# EAGLE design PCB (EAGLE 9.6.2)
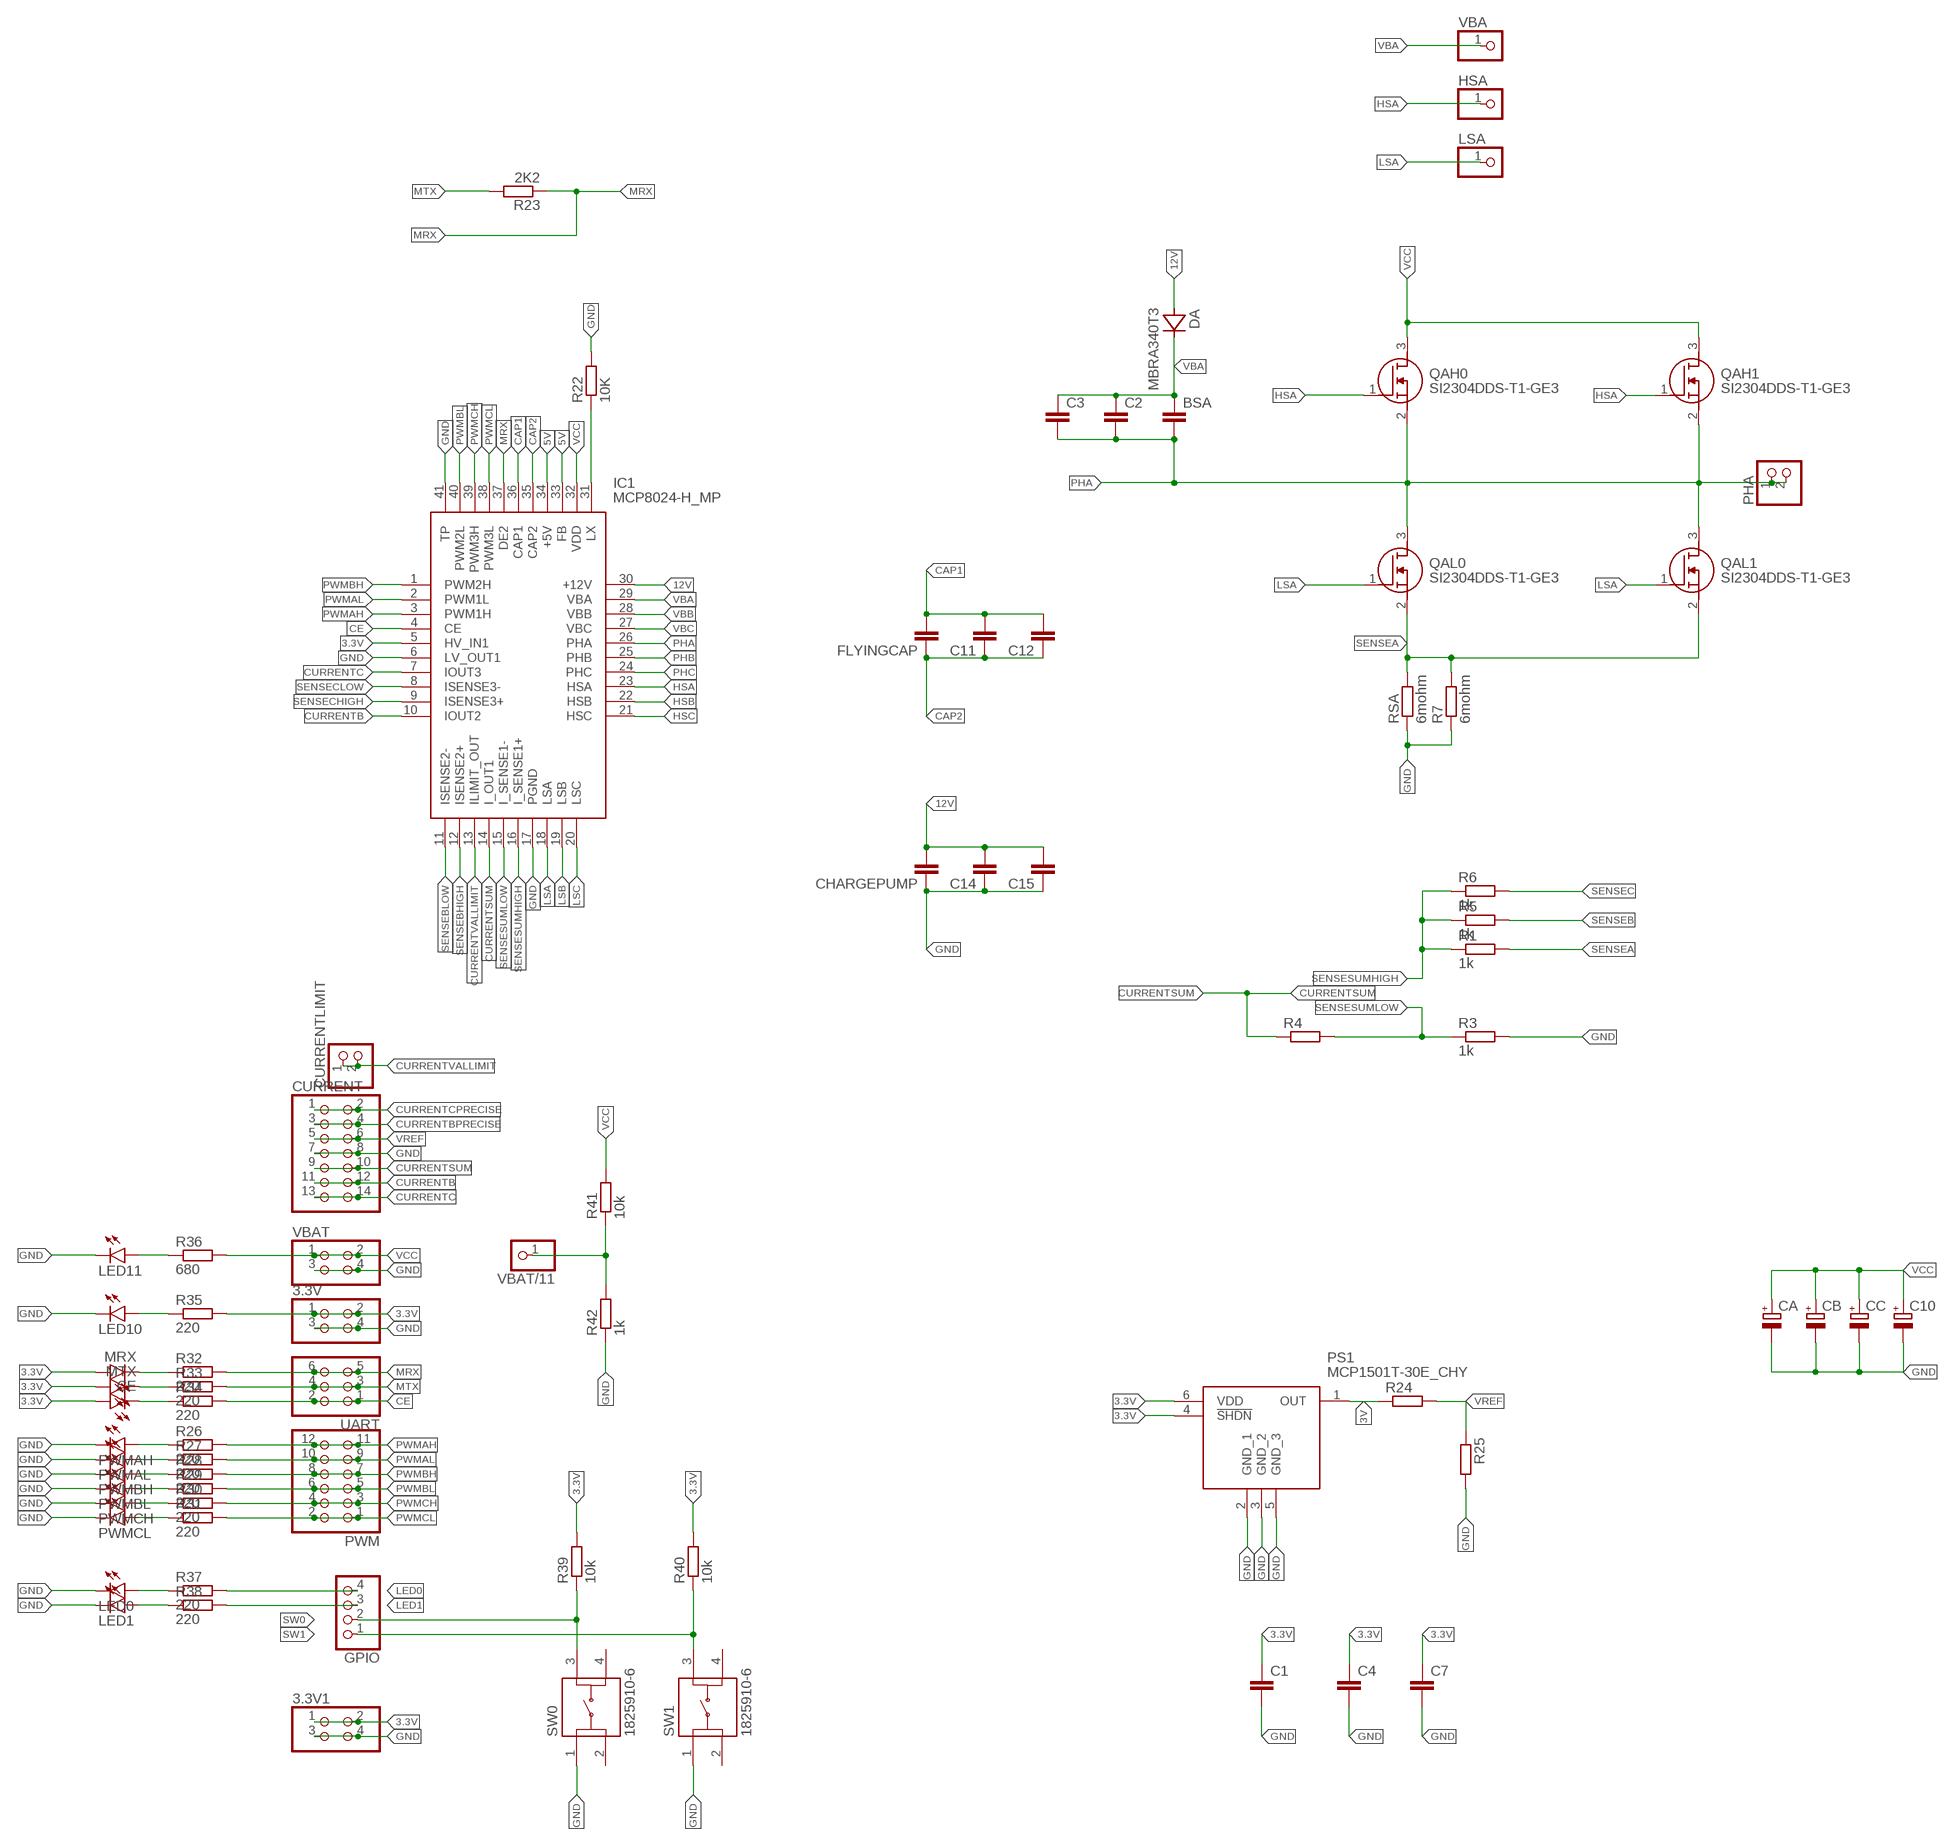
[diagram p0: schematic, sheet 1, part 1 of 2]
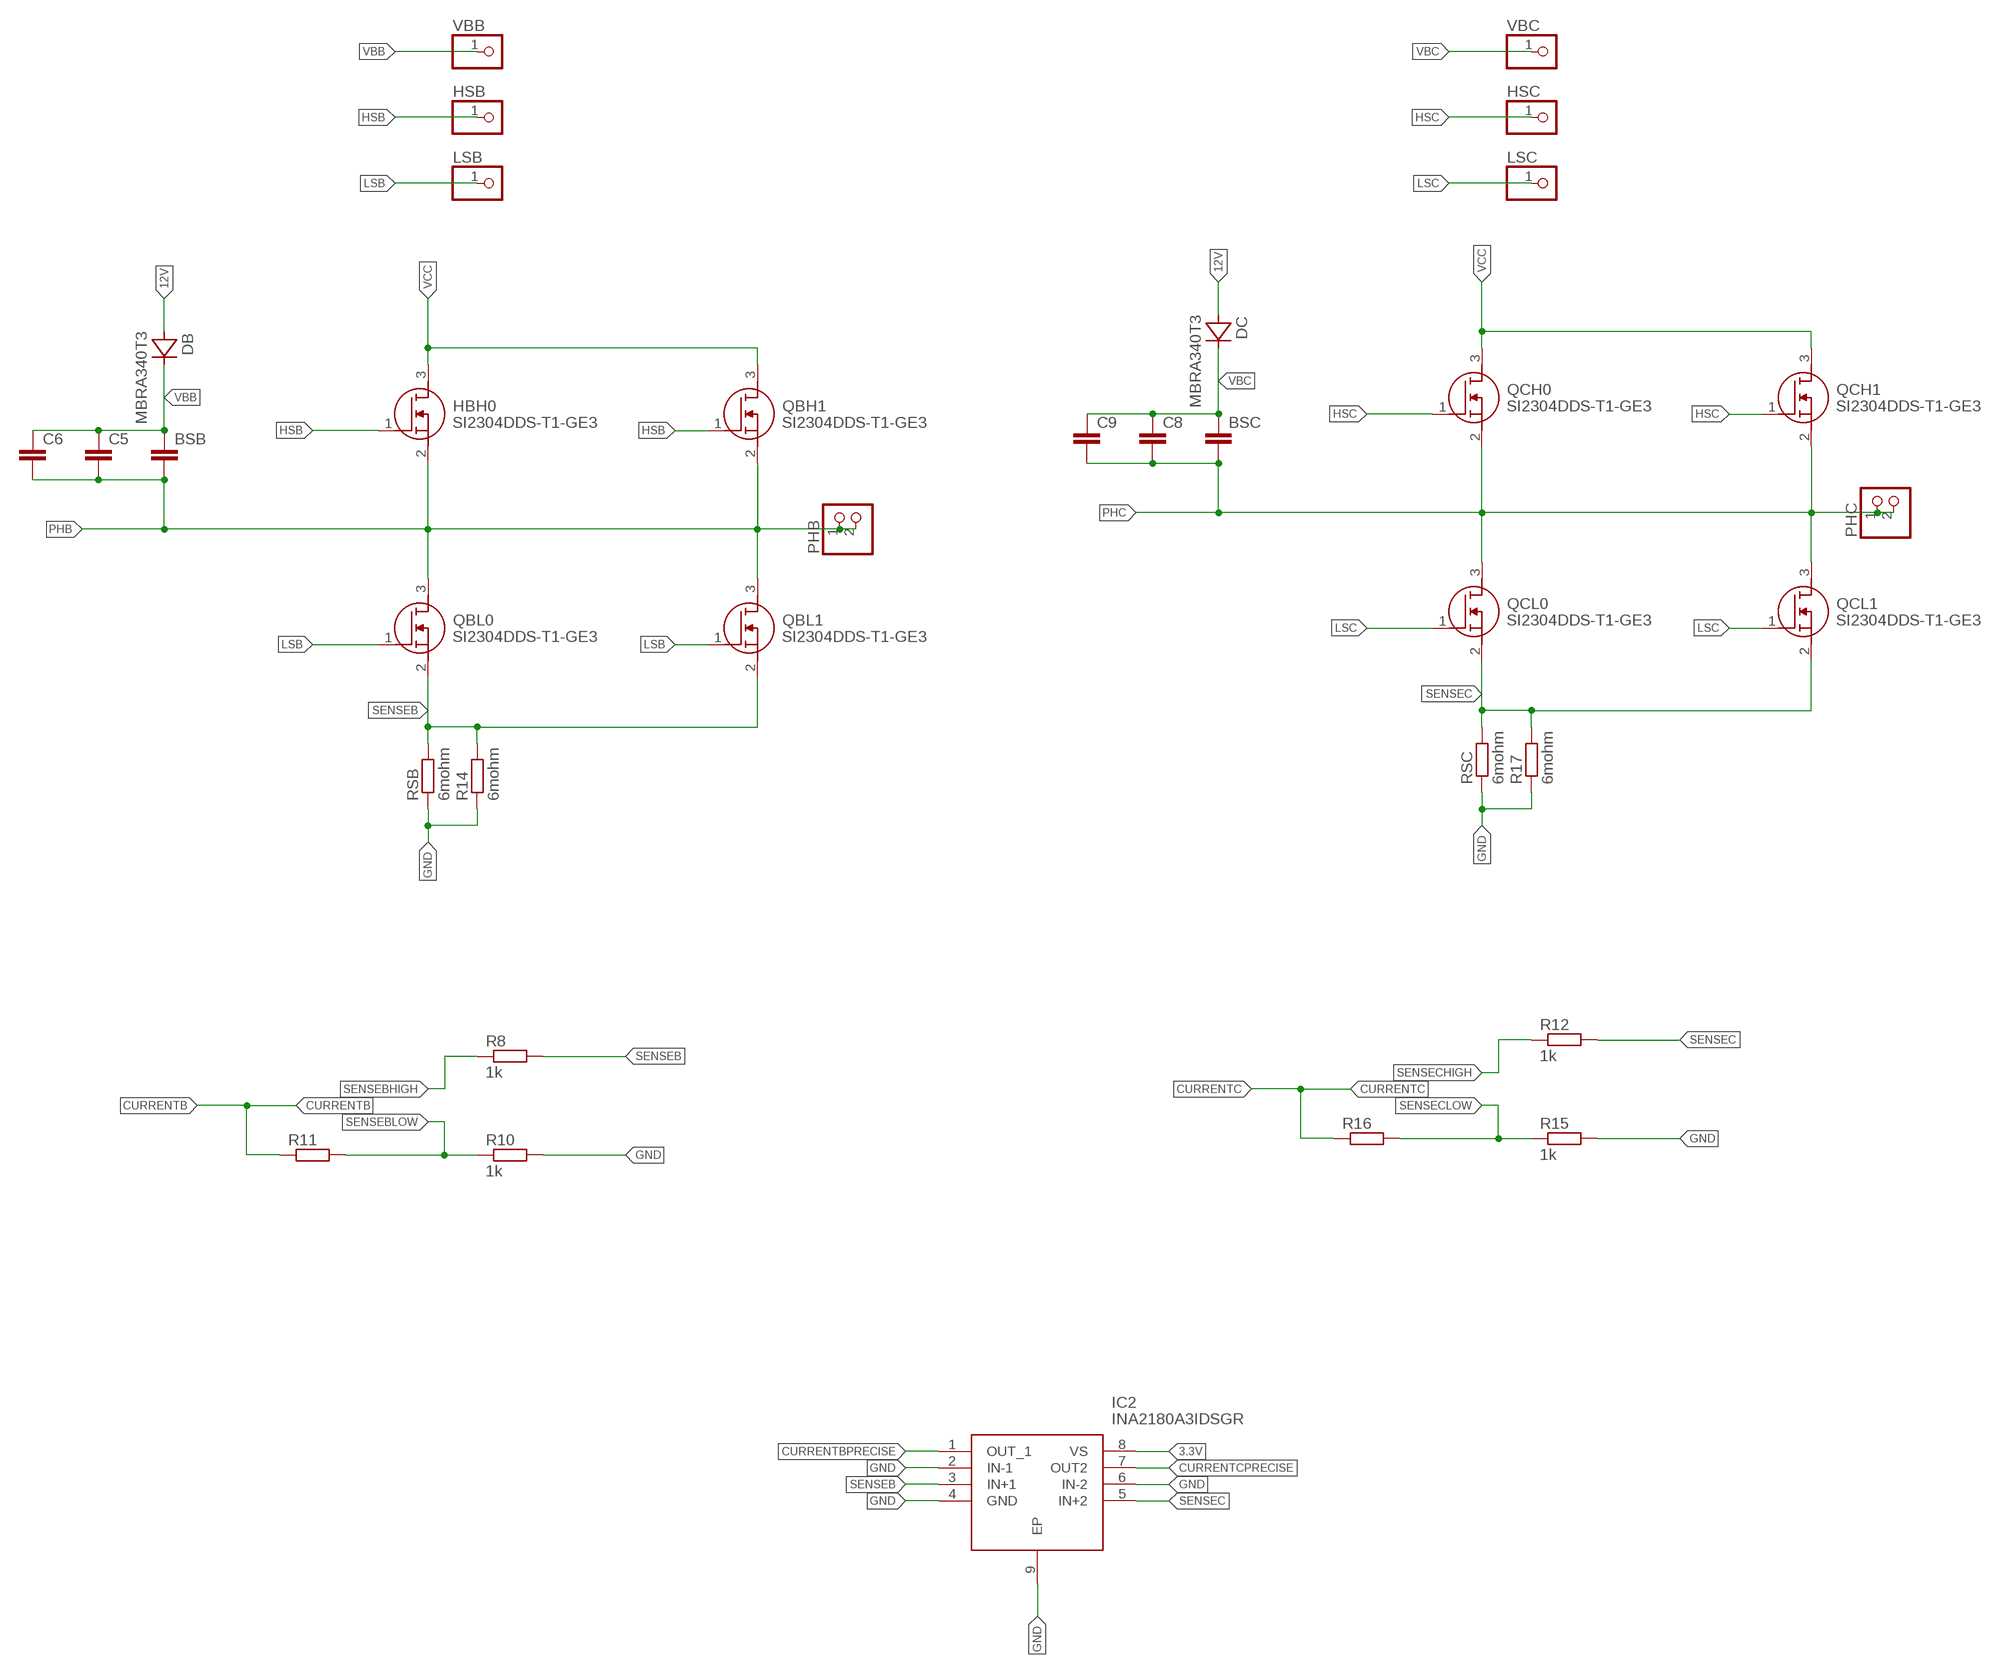
[diagram p1: schematic, sheet 1, part 2 of 2]

## Parts
3.3V  PINHD-2X2  [2X02]
3.3V1  PINHD-2X2  [2X02]
BSA  C-EUC0603  [C0603]
BSB  C-EUC0603  [C0603]
BSC  C-EUC0603  [C0603]
C1  C-EUC0603  [C0603]
C2  C-EUC0603  [C0603]
C3  C-EUC0603  [C0603]
C4  C-EUC0603  [C0603]
C5  C-EUC0603  [C0603]
C6  C-EUC0603  [C0603]
C7  C-EUC0603  [C0603]
C8  C-EUC0603  [C0603]
C9  C-EUC0603  [C0603]
C10  CPOL-EUE3.5-8  [E3,5-8]
C11  C-EUC0603  [C0603]
C12  C-EUC0603  [C0603]
C14  C-EUC0603  [C0603]
C15  C-EUC0603  [C0603]
CA  CPOL-EUE3.5-8  [E3,5-8]
CB  CPOL-EUE3.5-8  [E3,5-8]
CC  CPOL-EUE3.5-8  [E3,5-8]
CE  LEDCHIPLED_0805  [CHIPLED_0805]
CHARGEPUMP  C-EUC0603  [C0603]
CURRENT  PINHD-2X7  [2X07]
CURRENTLIMIT  PINHD-1X2  [1X02]
DA  MBRA340T3  [SMA]
DB  MBRA340T3  [SMA]
DC  MBRA340T3  [SMA]
FLYINGCAP  C-EUC0603  [C0603]
GPIO  PINHD-1X4  [1X04]
HBH0  SI2304DDS-T1-GE3  [SOT95P237X112-3N]
HSA  PINHD-1X1  [1X01]
HSB  PINHD-1X1  [1X01]
HSC  PINHD-1X1  [1X01]
IC1  MCP8024-H_MP  [QFN40P500X500X90-41N]
IC2  INA2180A3IDSGR  [SON50P200X200X80-9N]
LED0  LEDCHIPLED_0805  [CHIPLED_0805]
LED1  LEDCHIPLED_0805  [CHIPLED_0805]
LED10  LEDCHIPLED_0805  [CHIPLED_0805]
LED11  LEDCHIPLED_0805  [CHIPLED_0805]
LSA  PINHD-1X1  [1X01]
LSB  PINHD-1X1  [1X01]
LSC  PINHD-1X1  [1X01]
MRX  LEDCHIPLED_0805  [CHIPLED_0805]
MTX  LEDCHIPLED_0805  [CHIPLED_0805]
PHA  PINHD-1X2  [1X02]
PHB  PINHD-1X2  [1X02]
PHC  PINHD-1X2  [1X02]
PS1  MCP1501T-30E_CHY  [SOT95P270X145-6N]
PWM  PINHD-2X6  [2X06]
PWMAH  LEDCHIPLED_0805  [CHIPLED_0805]
PWMAL  LEDCHIPLED_0805  [CHIPLED_0805]
PWMBH  LEDCHIPLED_0805  [CHIPLED_0805]
PWMBL  LEDCHIPLED_0805  [CHIPLED_0805]
PWMCH  LEDCHIPLED_0805  [CHIPLED_0805]
PWMCL  LEDCHIPLED_0805  [CHIPLED_0805]
QAH0  SI2304DDS-T1-GE3  [SOT95P237X112-3N]
QAH1  SI2304DDS-T1-GE3  [SOT95P237X112-3N]
QAL0  SI2304DDS-T1-GE3  [SOT95P237X112-3N]
QAL1  SI2304DDS-T1-GE3  [SOT95P237X112-3N]
QBH1  SI2304DDS-T1-GE3  [SOT95P237X112-3N]
QBL0  SI2304DDS-T1-GE3  [SOT95P237X112-3N]
QBL1  SI2304DDS-T1-GE3  [SOT95P237X112-3N]
QCH0  SI2304DDS-T1-GE3  [SOT95P237X112-3N]
QCH1  SI2304DDS-T1-GE3  [SOT95P237X112-3N]
QCL0  SI2304DDS-T1-GE3  [SOT95P237X112-3N]
QCL1  SI2304DDS-T1-GE3  [SOT95P237X112-3N]
R1  1k  R-EU_R0805  [R0805]
R3  1k  R-EU_R0805  [R0805]
R4  R-EU_R0805  [R0805]
R5  1k  R-EU_R0805  [R0805]
R6  1k  R-EU_R0805  [R0805]
R7  6mohm  R-EU_R1206  [R1206]
R8  1k  R-EU_R0805  [R0805]
R10  1k  R-EU_R0805  [R0805]
R11  R-EU_R0805  [R0805]
R12  1k  R-EU_R0805  [R0805]
R14  6mohm  R-EU_R1206  [R1206]
R15  1k  R-EU_R0805  [R0805]
R16  R-EU_R0805  [R0805]
R17  6mohm  R-EU_R1206  [R1206]
R22  10K  R-EU_R0805  [R0805]
R23  2K2  R-EU_R0805  [R0805]
R24  R-EU_R0805  [R0805]
R25  R-EU_R0805  [R0805]
R26  220  R-EU_R0805  [R0805]
R27  220  R-EU_R0805  [R0805]
R28  220  R-EU_R0805  [R0805]
R29  220  R-EU_R0805  [R0805]
R30  220  R-EU_R0805  [R0805]
R31  220  R-EU_R0805  [R0805]
R32  220  R-EU_R0805  [R0805]
R33  220  R-EU_R0805  [R0805]
R34  220  R-EU_R0805  [R0805]
R35  220  R-EU_R0805  [R0805]
R36  680  R-EU_R0805  [R0805]
R37  220  R-EU_R0805  [R0805]
R38  220  R-EU_R0805  [R0805]
R39  10k  R-EU_R0805  [R0805]
R40  10k  R-EU_R0805  [R0805]
R41  10k  R-EU_R0805  [R0805]
R42  1k  R-EU_R0805  [R0805]
RSA  6mohm  R-EU_R1206  [R1206]
RSB  6mohm  R-EU_R1206  [R1206]
RSC  6mohm  R-EU_R1206  [R1206]
SW0  1825910-6  [1825910-6]
SW1  1825910-6  [1825910-6]
UART  PINHD-2X3  [2X03]
VBA  PINHD-1X1  [1X01]
VBAT  PINHD-2X2  [2X02]
VBAT/11  PINHD-1X1  [1X01]
VBB  PINHD-1X1  [1X01]
VBC  PINHD-1X1  [1X01]

## Nets
3.3V: 3.3V1.1 3.3V1.2 3.3V.1 3.3V.2 C1.1 C4.1 C7.1 CE.A IC1.5(HV_IN1) IC2.8(VS) MRX.A MTX.A PS1.4(!SHDN) PS1.6(VDD) R35.2 R39.2 R40.2
3V: PS1.1(OUT) R24.1
5V: IC1.33(FB) IC1.34(+5V)
12V: C14.2 C15.2 CHARGEPUMP.2 DA.A DB.A DC.A IC1.30(+12V)
CAP1: C11.2 C12.2 FLYINGCAP.2 IC1.36(CAP1)
CAP2: C11.1 C12.1 FLYINGCAP.1 IC1.35(CAP2)
CE: IC1.4(CE) R34.2 UART.1 UART.2
CURRENTB: CURRENT.11 CURRENT.12 IC1.10(IOUT2) R11.1
CURRENTBPRECISE: CURRENT.3 CURRENT.4 IC2.1(OUT_1)
CURRENTC: CURRENT.13 CURRENT.14 IC1.7(IOUT3) R16.1
CURRENTCPRECISE: CURRENT.1 CURRENT.2 IC2.7(OUT2)
CURRENTSUM: CURRENT.9 CURRENT.10 IC1.14(I_OUT1) R4.1
CURRENTVALLIMIT: CURRENTLIMIT.1 CURRENTLIMIT.2 IC1.13(ILIMIT_OUT)
GND: 3.3V1.3 3.3V1.4 3.3V.3 3.3V.4 C1.2 C4.2 C7.2 C10.- C14.1 C15.1 CA.- CB.- CC.- CHARGEPUMP.1 CURRENT.7 CURRENT.8 IC1.6(LV_OUT1) IC1.17(PGND) IC1.41(TP) IC2.2(IN-1) IC2.4(GND) IC2.6(IN-2) IC2.9(EP) LED0.C LED1.C LED10.C LED11.C PS1.2(GND_1) PS1.3(GND_2) PS1.5(GND_3) PWMAH.C PWMAL.C PWMBH.C PWMBL.C PWMCH.C PWMCL.C R3.2 R7.1 R10.2 R14.1 R15.2 R17.1 R22.2 R25.2 R42.1 RSA.1 RSB.1 RSC.1 SW0.1 SW1.1 VBAT.3 VBAT.4
HSA: HSA.1 IC1.23(HSA) QAH0.1(G) QAH1.1(G)
HSB: HBH0.1(G) HSB.1 IC1.22(HSB) QBH1.1(G)
HSC: HSC.1 IC1.21(HSC) QCH0.1(G) QCH1.1(G)
LED0: GPIO.4 R37.2
LED1: GPIO.3 R38.2
LSA: IC1.18(LSA) LSA.1 QAL0.1(G) QAL1.1(G)
LSB: IC1.19(LSB) LSB.1 QBL0.1(G) QBL1.1(G)
LSC: IC1.20(LSC) LSC.1 QCL0.1(G) QCL1.1(G)
MRX: IC1.37(DE2) R23.1 R32.2 UART.5 UART.6
MTX: R23.2 R33.2 UART.3 UART.4
N$1: IC1.31(LX) R22.1
N$2: PWMAH.A R26.1
N$3: PWMAL.A R27.1
N$4: PWMBH.A R28.1
N$5: PWMBL.A R29.1
N$6: PWMCH.A R30.1
N$7: PWMCL.A R31.1
N$8: MRX.C R32.1
N$9: MTX.C R33.1
N$10: CE.C R34.1
N$11: LED10.A R35.1
N$12: LED11.A R36.1
N$13: LED0.A R37.1
N$14: LED1.A R38.1
N$15: R41.1 R42.2 VBAT/11.1
PHA: BSA.2 C2.2 C3.2 IC1.26(PHA) PHA.1 PHA.2 QAH0.2(S) QAH1.2(S) QAL0.3(D) QAL1.3(D)
PHB: BSB.2 C5.2 C6.2 HBH0.2(S) IC1.25(PHB) PHB.1 PHB.2 QBH1.2(S) QBL0.3(D) QBL1.3(D)
PHC: BSC.2 C8.2 C9.2 IC1.24(PHC) PHC.1 PHC.2 QCH0.2(S) QCH1.2(S) QCL0.3(D) QCL1.3(D)
PWMAH: IC1.3(PWM1H) PWM.11 PWM.12 R26.2
PWMAL: IC1.2(PWM1L) PWM.9 PWM.10 R27.2
PWMBH: IC1.1(PWM2H) PWM.7 PWM.8 R28.2
PWMBL: IC1.40(PWM2L) PWM.5 PWM.6 R29.2
PWMCH: IC1.39(PWM3H) PWM.3 PWM.4 R30.2
PWMCL: IC1.38(PWM3L) PWM.1 PWM.2 R31.2
SENSEA: QAL0.2(S) QAL1.2(S) R1.2 R7.2 RSA.2
SENSEB: IC2.3(IN+1) QBL0.2(S) QBL1.2(S) R5.2 R8.2 R14.2 RSB.2
SENSEBHIGH: IC1.12(ISENSE2+) R8.1
SENSEBLOW: IC1.11(ISENSE2-) R10.1 R11.2
SENSEC: IC2.5(IN+2) QCL0.2(S) QCL1.2(S) R6.2 R12.2 R17.2 RSC.2
SENSECHIGH: IC1.9(ISENSE3+) R12.1
SENSECLOW: IC1.8(ISENSE3-) R15.1 R16.2
SENSESUMHIGH: IC1.16(I_SENSE1+) R1.1 R5.1 R6.1
SENSESUMLOW: IC1.15(I_SENSE1-) R3.1 R4.2
SW0: GPIO.2 R39.1 SW0.3
SW1: GPIO.1 R40.1 SW1.3
VBA: BSA.1 C2.1 C3.1 DA.C IC1.29(VBA) VBA.1
VBB: BSB.1 C5.1 C6.1 DB.C IC1.28(VBB) VBB.1
VBC: BSC.1 C8.1 C9.1 DC.C IC1.27(VBC) VBC.1
VCC: C10.+ CA.+ CB.+ CC.+ HBH0.3(D) IC1.32(VDD) QAH0.3(D) QAH1.3(D) QBH1.3(D) QCH0.3(D) QCH1.3(D) R36.2 R41.2 VBAT.1 VBAT.2
VREF: CURRENT.5 CURRENT.6 R24.2 R25.1
Unconnected: SW0.2 SW0.4 SW1.2 SW1.4

## Library data of the parts
3.3V 3.3V1 VBAT = pinhead:PINHD-2X2: PIN HEADER
BSA BSB BSC C1-C9 C11 C12 C14 C15 CHARGEPUMP FLYINGCAP = resistor:C-EU: CAPACITOR, European symbol
C10 CA CB CC = resistor:CPOL-EU: POLARIZED CAPACITOR, European symbol
CE LED0 LED1 LED10 LED11 MRX MTX PWMAH PWMAL PWMBH PWMBL PWMCH PWMCL = led:LED: LED OSRAM: - CHIPLED LG R971, LG N971, LY N971, LG Q971, LY Q971, LO R971, LY R971 LH N974, LH R974 LS Q976, LO Q976, LY Q976 LO Q996 - Hyper CHIPLED LW Q18S LB Q993, LB Q99A, LB R99A - SideLED LS A670, LO A670, LY A670, LG A670, LP A670 LB A673, LV A673, LT A673, LW A673 LH A674 LY A675 LS A676, LA A676, LO A676, LY A676, LW A676 LS A679, LY A679, LG A679 - Hyper Micro SIDELED® LS Y876, LA Y876, LO Y876, LY Y876 LT Y87S - SmartLED LW L88C, LW L88S LB L89C, LB L89S, LG L890 LS L89K, LO L89K, LY L89K LS L896, LA L896, LO L896, LY L896 - TOPLED LS T670, LO T670, LY T670, LG T670, LP T670 LSG T670, LSP T670, LSY T670, LOP T670, LYG T670 LG T671, LOG T671, LSG T671 LB T673, LV T673, LT T673, LW T673 LH T674 LS T676, LA T676, LO T676, LY T676, LB T676, LH T676, LSB T676, LW T676 LB T67C, LV T67C, LT T67C, LS T67K, LO T67K, LY T67K, LW E67C LS E67B, LA E67B, LO E67B, LY E67B, LB E67C, LV E67C, LT E67C LW T67C LS T679, LY T679, LG T679 LS T770, LO T770, LY T770, LG T770, LP T770 LB T773, LV T773, LT T773, LW T773 LH T774 LS E675, LA E675, LY E675, LS T675 LS T776, LA T776, LO T776, LY T776, LB T776 LHGB T686 LT T68C, LB T68C - Hyper Mini TOPLED® LB M676 - Mini TOPLED Santana® LG M470 LS M47K, LO M47K, LY M47K Source: http://www.osram.convergy.de LUXEON: - LUMILED® LXK2-PW12-R00, LXK2-PW12-S00, LXK2-PW14-U00, LXK2-PW14-V00 LXK2-PM12-R00, LXK2-PM12-S00, LXK2-PM14-U00 LXK2-PE12-Q00, LXK2-PE12-R00, LXK2-PE12-S00, LXK2-PE14-T00, LXK2-PE14-U00 LXK2-PB12-K00, LXK2-PB12-L00, LXK2-PB12-M00, LXK2-PB14-N00, LXK2-PB14-P00, LXK2-PB14-Q00 LXK2-PR12-L00, LXK2-PR12-M00, LXK2-PR14-Q00, LXK2-PR14-R00 LXK2-PD12-Q00, LXK2-PD12-R00, LXK2-PD12-S00 LXK2-PH12-R00, LXK2-PH12-S00 LXK2-PL12-P00, LXK2-PL12-Q00, LXK2-PL12-R00 Source: www.luxeon.com KINGBRIGHT: KA-3528ASYC Source: www.kingbright.com
CURRENT = pinhead:PINHD-2X7: PIN HEADER
CURRENTLIMIT PHA PHB PHC = pinhead:PINHD-1X2: PIN HEADER
DA DB DC = diode:MBRA340T3: Surface Mount Schottky Power Rectifier Source: http://www.onsemi.com/pub_link/Collateral/MBRA340T3-D.PDF
GPIO = pinhead:PINHD-1X4: PIN HEADER
HBH0 QAH0 QAH1 QAL0 QAL1 QBH1 QBL0 QBL1 QCH0 QCH1 QCL0 QCL1 = SamacSys_Parts:SI2304DDS-T1-GE3: Vishay SI2304DDS-T1-GE3 N-channel MOSFET Transistor, 3.6 A, 30 V, 3-Pin TO-236 Source: Datasheet; DESCRIPTION: Vishay SI2304DDS-T1-GE3 N-channel MOSFET Transistor, 3.6 A, 30 V, 3-Pin TO-236; HEIGHT: 1.12mm; MANUFACTURER_NAME: Vishay; MANUFACTURER_PART_NUMBER: SI2304DDS-T1-GE3; MOUSER_PART_NUMBER: 781-SI2304DDS-GE3; MOUSER_PRICE-STOCK: https://www.mouser.co.uk/ProductDetail/Vishay-Semiconductors/SI2304DDS-T1-GE3/?qs=kt16UJ73eEFzaHFCSwuD9w%3D%3D
HSA HSB HSC LSA LSB LSC VBA VBAT/11 VBB VBC = pinhead:PINHD-1X1: PIN HEADER
IC1 = SamacSys_Parts:MCP8024-H_MP: 3-Phase Brushless DC Motor Driver QFN40 Microchip MCP8024-H/MP, Brushless DC Motor Driver 3-Phase Brushless DC Motor,, 40-Pin QFN Source: Datasheet <https://datasheet.datasheetarchive.com/originals/distributors/Datasheets-DGA5/484375.pdf>; DESCRIPTION: 3-Phase Brushless DC Motor Driver QFN40 Microchip MCP8024-H/MP, Brushless DC Motor Driver 3-Phase Brushless DC Motor,, 40-Pin QFN; HEIGHT: 0.9mm; MANUFACTURER_NAME: Microchip; MANUFACTURER_PART_NUMBER: MCP8024-H/MP; MOUSER_PART_NUMBER: 579-MCP8024-H/MP; MOUSER_PRICE-STOCK: https://www.mouser.co.uk/ProductDetail/Microchip-Technology/MCP8024-H-MP?qs=FtPMRLvtI71ahAJDPpP4OA%3D%3D
IC2 = SamacSys_Parts:INA2180A3IDSGR: Current Sense Amplifiers 26V, dual channel, 350kHz current sense amplifier 8-WSON -40 to 125 Source: Datasheet <https://www.ti.com/lit/gpn/INA2180>; DESCRIPTION: Current Sense Amplifiers 26V, dual channel, 350kHz current sense amplifier 8-WSON -40 to 125; HEIGHT: 0.8mm; MANUFACTURER_NAME: Texas Instruments; MANUFACTURER_PART_NUMBER: INA2180A3IDSGR; MOUSER_PART_NUMBER: 595-INA2180A3IDSGR; MOUSER_PRICE-STOCK: https://www.mouser.co.uk/ProductDetail/Texas-Instruments/INA2180A3IDSGR?qs=vmHwEFxEFR%2Fy8A0ATea%2F2g%3D%3D
PS1 = SamacSys_Parts:MCP1501T-30E_CHY: Voltage References Precision Buffered Voltage Reference Source: Datasheet <https://componentsearchengine.com/Datasheets/1/MCP1501T-30E_CHY.pdf>; DESCRIPTION: Voltage References Precision Buffered Voltage Reference; HEIGHT: 1.45mm; MANUFACTURER_NAME: Microchip; MANUFACTURER_PART_NUMBER: MCP1501T-30E/CHY; MOUSER_PART_NUMBER: 579-MCP1501T-30E/CHY; MOUSER_PRICE-STOCK: https://www.mouser.co.uk/ProductDetail/Microchip-Technology/MCP1501T-30E-CHY?qs=8cKuZ6Ok2lblWEEkgAvf9Q%3D%3D
PWM = pinhead:PINHD-2X6: PIN HEADER
R1 R3-R8 R10-R12 R14-R17 R22-R42 RSA RSB RSC = resistor:R-EU_: RESISTOR, European symbol
SW0 SW1 = Switch:1825910-6: SWITCH TACTILE SPST-NO 0.05A 24V Manufacturer's datasheet <https://www.te.com/commerce/DocumentDelivery/DDEController?Action=srchrtrv&DocNm=1825910&DocType=Customer+Drawing&DocLang=English>; CREATED_BY: PCBLayout.com; DIGIKEY_PART_NUMBER: 450-1650-ND; MANUFACTURER: TE Connectivity ALCOSWITCH Switches; MPN: 1825910-6
UART = pinhead:PINHD-2X3: PIN HEADER

## Board
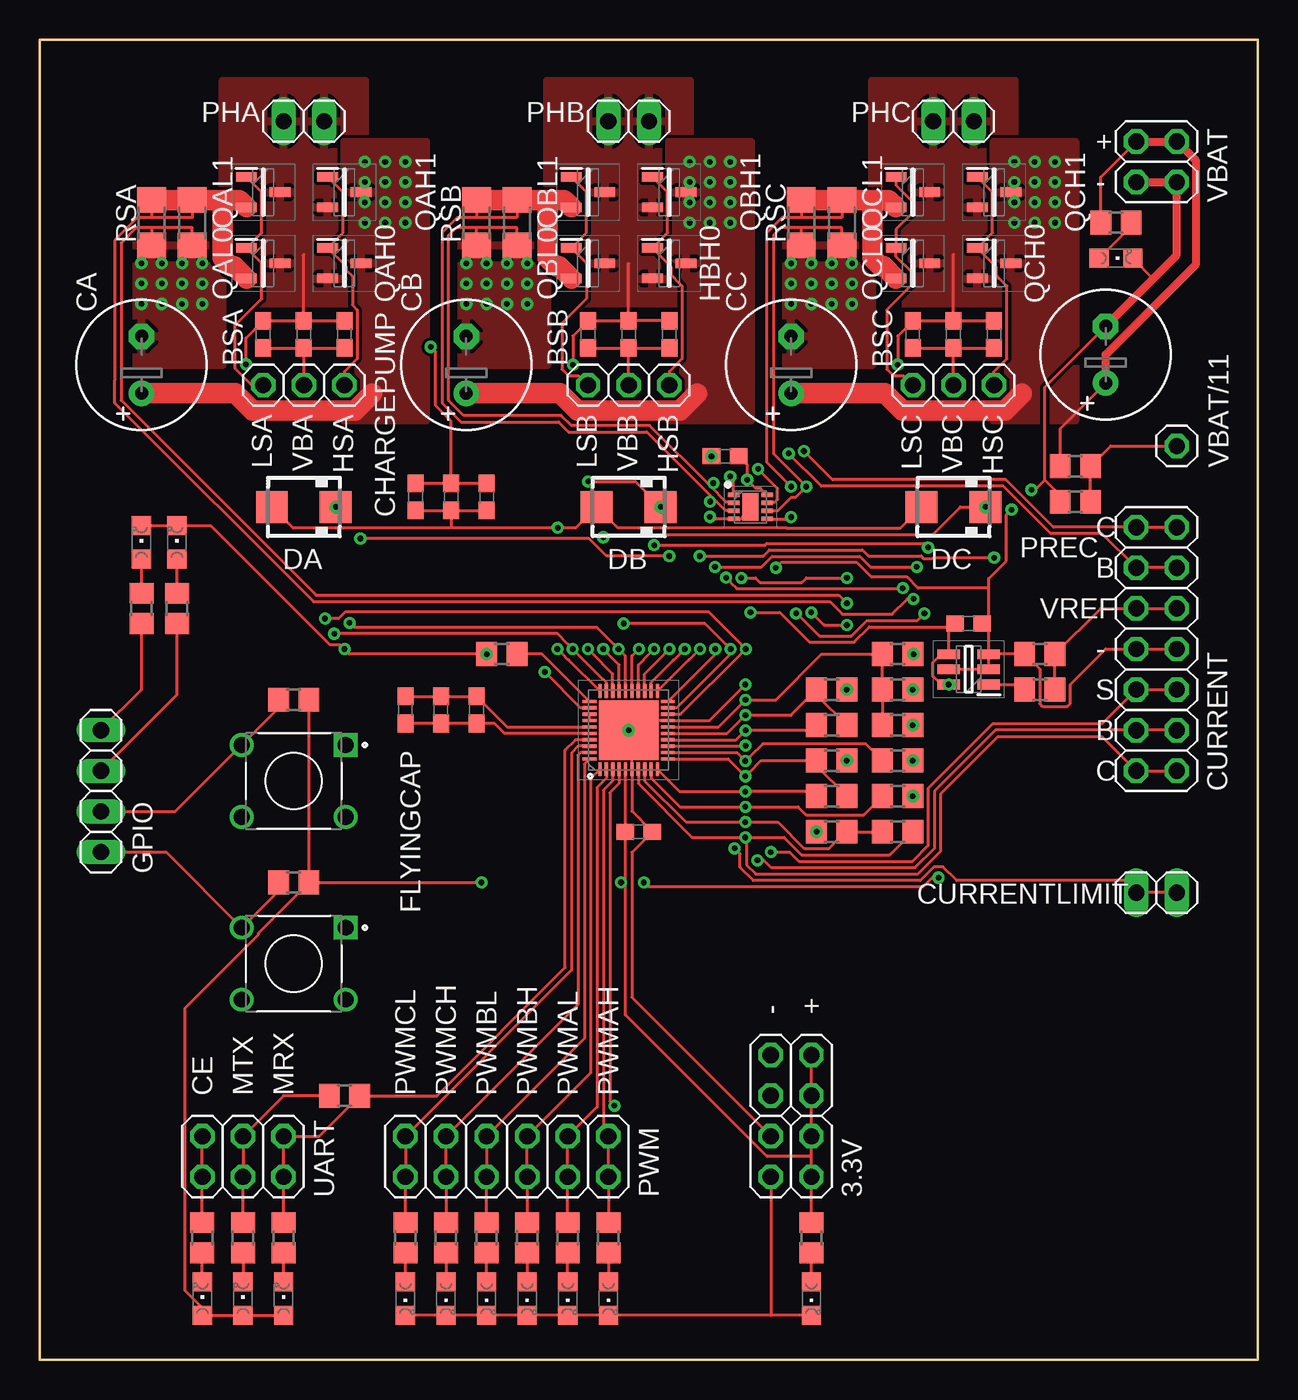
[diagram p2: board, top side]
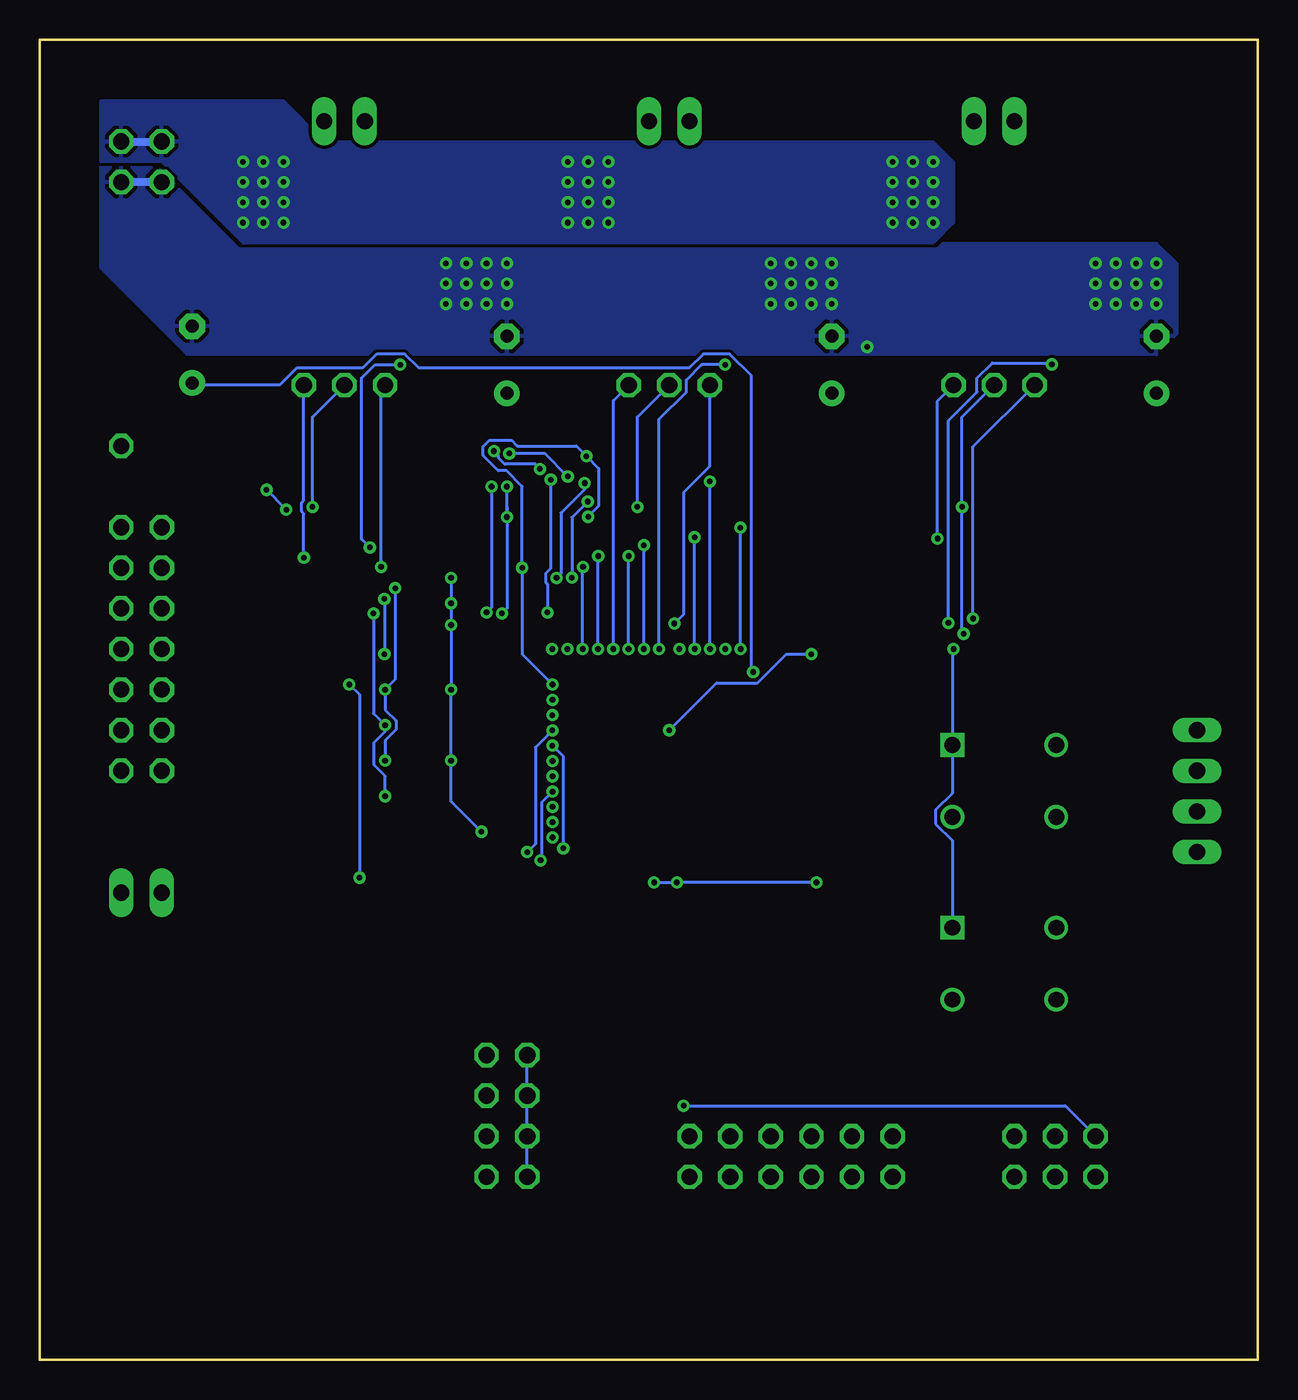
[diagram p3: board, bottom side, seen from below]

Size 76.2 x 82.55 mm. Coordinates in mm from the lower left corner, seen from the top.
Outline: 0,0 0,82.55 76.2,82.55 76.2,0 0,0
Copper layers (1*16): Top 0.035mm / dielectric 1.5mm / Bottom 0.035mm
Design rules "default *": minimum track width 5mil, minimum drill 0.35mm, track to track 0.2mm, track to pad 0.2mm, pad to pad 5mil, via to via 0.2mm, smd to smd 0mil, copper to edge 0.25mm, drill to drill 0.5mm, minimum pad ring 0.2mm, minimum via ring 8mil, stop-mask expansion 4mil, vias tented up to drill 0mil, thermal gap 10mil

### Footprints (pad centres in the part's own frame; a part is rotated, then mirrored left to right if it is on the bottom)
2X02 = drill 1.016 octagon: 1 -1.27,-1.27; 2 -1.27,1.27; 3 1.27,-1.27; 4 1.27,1.27
C0603 = smd 1.1 x 1: 1 -0.85,0; 2 0.85,0
E3,5-8 = drill 0.813 pad 1.6: + -1.778,0 | drill 0.813 pad 1.6 octagon: - 1.778,0
CHIPLED_0805 = smd 1.2 x 1.2: A 0,-1.05; C 0,1.05
2X07 = drill 1.016 octagon: 1 -7.62,-1.27; 2 -7.62,1.27; 3 -5.08,-1.27; 4 -5.08,1.27; 5 -2.54,-1.27; 6 -2.54,1.27; 7 0,-1.27; 8 0,1.27; 9 2.54,-1.27; 10 2.54,1.27; 11 5.08,-1.27; 12 5.08,1.27; 13 7.62,-1.27; 14 7.62,1.27
1X02 = drill 1.016 long: 1 -1.27,0; 2 1.27,0
SMA = smd 2 x 2: A 2,0; C -2,0
1X04 = drill 1.016 long: 1 -3.81,0; 2 -1.27,0; 3 1.27,0; 4 3.81,0
SOT95P237X112-3N = smd 1.3 x 0.6: 1 -1.05,0.95; 2 -1.05,-0.95; 3 1.05,0
1X01 = drill 1.016 octagon: 1 0,0
QFN40P500X500X90-41N = smd 0.85 x 0.2: 1 -2.45,1.8; 2 -2.45,1.4; 3 -2.45,1; 4 -2.45,0.6; 5 -2.45,0.2; 6 -2.45,-0.2; 7 -2.45,-0.6; 8 -2.45,-1; 9 -2.45,-1.4; 10 -2.45,-1.8; 21 2.45,-1.8; 22 2.45,-1.4; 23 2.45,-1; 24 2.45,-0.6; 25 2.45,-0.2; 26 2.45,0.2; 27 2.45,0.6; 28 2.45,1; 29 2.45,1.4; 30 2.45,1.8 | smd 0.2 x 0.85: 11 -1.8,-2.45; 12 -1.4,-2.45; 13 -1,-2.45; 14 -0.6,-2.45; 15 -0.2,-2.45; 16 0.2,-2.45; 17 0.6,-2.45; 18 1,-2.45; 19 1.4,-2.45; 20 1.8,-2.45; 31 1.8,2.45; 32 1.4,2.45; 33 1,2.45; 34 0.6,2.45; 35 0.2,2.45; 36 -0.2,2.45; 37 -0.6,2.45; 38 -1,2.45; 39 -1.4,2.45; 40 -1.8,2.45 | smd 3.7 x 3.7: 41 0,0
SON50P200X200X80-9N = smd 0.7 x 0.3: 1 -1.05,0.75; 2 -1.05,0.25; 3 -1.05,-0.25; 4 -1.05,-0.75; 5 1.05,-0.75; 6 1.05,-0.25; 7 1.05,0.25; 8 1.05,0.75 | smd 1 x 1.7: 9 0,0
SOT95P270X145-6N = smd 1.4 x 0.6: 1 -1.25,0.95; 2 -1.25,0; 3 -1.25,-0.95; 4 1.25,-0.95; 5 1.25,0; 6 1.25,0.95
2X06 = drill 1.016 octagon: 1 -6.35,-1.27; 2 -6.35,1.27; 3 -3.81,-1.27; 4 -3.81,1.27; 5 -1.27,-1.27; 6 -1.27,1.27; 7 1.27,-1.27; 8 1.27,1.27; 9 3.81,-1.27; 10 3.81,1.27; 11 6.35,-1.27; 12 6.35,1.27
R0805 = smd 1.3 x 1.5: 1 -0.95,0; 2 0.95,0
R1206 = smd 1.6 x 1.803: 1 -1.422,0; 2 1.422,0
1825910-6 = drill 0.99 square: 1 3.25,2.25 | drill 0.99: 2 3.25,-2.25; 3 -3.25,2.25; 4 -3.25,-2.25
2X03 = drill 1.016 octagon: 1 -2.54,-1.27; 2 -2.54,1.27; 3 0,-1.27; 4 0,1.27; 5 2.54,-1.27; 6 2.54,1.27

### Placement (x,y rotation side)
3.3V  46.99,12.7 180 top
3.3V1  46.99,17.78 180 top
BSA  13.97,64.14 90 top
BSB  34.29,64.14 90 top
BSC  54.61,64.14 90 top
C1  58.1,46.04 0 top
C2  19.05,64.14 90 top
C3  16.51,64.14 90 top
C4  37.46,33.02 0 top
C5  36.83,64.14 90 top
C6  39.37,64.14 90 top
C7  42.86,56.52 180 top
C8  57.15,64.14 90 top
C9  59.69,64.14 90 top
C10  66.68,62.86 90 top
C11  25.08,40.64 270 top
C12  27.3,40.64 270 top
C14  25.72,53.97 270 top
C15  27.94,53.97 270 top
CA  6.35,62.23 90 top
CB  26.67,62.23 90 top
CC  46.99,62.23 90 top
CE  10.16,3.81 0 top
CHARGEPUMP  23.49,53.97 270 top
CURRENT  69.85,44.45 270 top
CURRENTLIMIT  69.85,29.21 0 top
DA  16.51,53.34 180 top
DB  36.83,53.34 180 top
DC  57.15,53.34 180 top
FLYINGCAP  22.86,40.64 270 top
GPIO  3.81,35.56 90 top
HBH0  39.37,68.58 0 top
HSA  19.05,60.96 180 top
HSB  39.37,60.96 90 top
HSC  59.69,60.96 270 top
IC1  36.83,39.37 90 top
IC2  44.45,53.34 0 top
LED0  6.35,51.12 0 top
LED1  8.57,51.12 0 top
LED10  48.26,3.81 180 top
LED11  67.31,68.9 270 top
LSA  13.97,60.96 180 top
LSB  34.29,60.96 90 top
LSC  54.61,60.96 270 top
MRX  15.24,3.81 0 top
MTX  12.7,3.81 0 top
PHA  16.51,77.47 0 top
PHB  36.83,77.47 0 top
PHC  57.15,77.47 0 top
PS1  58.1,43.18 180 top
PWM  29.21,12.7 0 top
PWMAH  35.56,3.81 180 top
PWMAL  33.02,3.81 180 top
PWMBH  30.48,3.81 180 top
PWMBL  27.94,3.81 180 top
PWMCH  25.4,3.81 180 top
PWMCL  22.86,3.81 180 top
QAH0  19.05,68.58 0 top
QAH1  19.05,73.03 0 top
QAL0  13.97,68.58 0 top
QAL1  13.97,73.03 0 top
QBH1  39.37,73.03 0 top
QBL0  34.29,68.58 0 top
QBL1  34.29,73.03 0 top
QCH0  59.69,68.58 0 top
QCH1  59.69,73.03 0 top
QCL0  54.61,68.58 0 top
QCL1  54.61,73.03 0 top
R1  53.66,44.13 0 top
R3  49.53,41.91 0 top
R4  49.53,39.69 0 top
R5  53.66,41.91 0 top
R6  53.66,39.69 0 top
R7  9.53,71.12 90 top
R8  53.66,37.47 0 top
R10  49.53,37.47 0 top
R11  49.53,35.24 0 top
R12  53.66,35.24 0 top
R14  27.3,71.12 90 top
R15  49.53,33.02 180 top
R16  53.66,33.02 180 top
R17  50.16,71.12 90 top
R22  28.89,44.13 180 top
R23  19.05,16.51 180 top
R24  62.55,41.91 0 top
R25  62.55,44.13 180 top
R26  35.56,7.62 90 top
R27  33.02,7.62 90 top
R28  30.48,7.62 90 top
R29  27.94,7.62 90 top
R30  25.4,7.62 90 top
R31  22.86,7.62 90 top
R32  15.24,7.62 90 top
R33  12.7,7.62 90 top
R34  10.16,7.62 90 top
R35  48.26,7.62 90 top
R36  67.31,71.12 180 top
R37  6.35,46.99 270 top
R38  8.57,46.99 270 top
R39  15.88,41.27 0 top
R40  15.88,29.84 0 top
R41  64.77,55.88 180 top
R42  64.77,53.66 0 top
RSA  6.99,71.12 90 top
RSB  29.84,71.12 90 top
RSC  47.62,71.12 90 top
SW0  15.88,36.2 0 top
SW1  15.88,24.77 0 top
UART  12.7,12.7 0 top
VBA  16.51,60.96 180 top
VBAT  69.85,74.93 270 top
VBAT/11  71.12,57.15 0 top
VBB  36.83,60.96 90 top
VBC  57.15,60.96 270 top

### Tracks (layer width: path | path; a pad name or v marks a point on that pad's centre or on a via)
3.3V  (via drill 0.35)
  Top 0.2: MRX.A MTX.A CE.A 10.16,3.24 9.1,4.3 9.1,22.01 13.67,26.58 13.67,26.69 R40.2 | R35.2 3.3V.2 48.26,12.7 | 48.26,12.7 3.3V.1 3.3V1.2 3.3V1.1 | 48.26,12.7 45.49,12.7 36.63,21.56 36.63,29.84 | 36.63,29.84 36.63,33.02 | 36.63,33.02 IC1.5 | R40.2 R39.2 | R40.2 v27.62,29.84 | v36.35,29.84 36.63,29.84 | v56.21,30.15 55.82,30.15 55.24,29.57 38.06,29.57 v37.78,29.84 | PS1.6 56.38,42.23 55.85,42.76 55.85,43.6 56.38,44.13 PS1.4 56.85,45.64 57.04,45.83 | 57.04,45.83 C1.1 | C4.1 36.63,33.02 | v44.45,46.74 46.28,46.74 48.14,44.87 50.93,44.87 51.88,45.83 57.04,45.83 | C7.1 44.24,55.98 44.24,55.44 44.25,55.43 v44.25,55.04
  Top 0.203: v44.25,55.04 44.79,54.49 45.07,54.49 45.48,54.09 IC2.8
  Bottom 0.2: v27.62,29.84 v36.35,29.84 v37.78,29.84 | PS1.6 56.21,41.59 v56.21,30.15 | v44.25,55.04 44.25,49.49 44.56,49.18 44.56,48.61 44.45,48.5 v44.45,46.74
  other vias: 56.85,42.23
3V
  Top 0.2: PS1.1 61.28,42.23 R24.1
5V
  Top 0.2: IC1.34 IC1.33
12V  (via drill 0.35)
  Top 0.2: IC1.30 33.08,43.77 33.05,43.77 32.65,44.17 v32.37,44.45 | CHARGEPUMP.2 C14.2 | C14.2 C15.2 | C14.2 25.72,52.04
  Top 0.203: DA.A 15.81,52.04 25.72,52.04 v32.38,52.04 33.53,52.04 DB.A 36.13,52.04 46.7,52.04 46.71,52.02 53.84,52.02 DC.A
  Bottom 0.2: v32.37,44.45 32.37,52.02 v32.38,52.04
CAP1
  Top 0.2: IC1.36 29.06,39.17 28.44,39.79 C12.2 C11.2 FLYINGCAP.2
CAP2
  Top 0.2: FLYINGCAP.1 C11.1 C12.1 29.23,39.57 IC1.35
CE  (via drill 0.35)
  Top 0.2: IC1.4 36.23,36.04 35.66,35.46 35.66,16.15 v35.93,15.87 | UART.2 UART.1 R34.2
  Bottom 0.2: v35.93,15.87 12.06,15.87 UART.2
CURRENTB  (via drill 0.35)
  Top 0.2: IC1.10 40.02,35.53 v44.13,35.53 48.29,35.53 R11.1 | v44.88,31.23 45.28,31.23 45.74,30.77 54.75,30.77 55.96,31.98 55.96,35.57 59.76,39.37 CURRENT.11 CURRENT.12
  Bottom 0.2: v44.13,35.53 44.41,35.25 44.81,34.86 44.81,31.31 v44.88,31.23
CURRENTBPRECISE  (via drill 0.35)
  Top 0.2: v46.84,56.68 48.88,54.64 60.27,54.64 63.24,51.67 66.44,51.67 CURRENT.3 CURRENT.4
  Top 0.203: IC2.1 43.4,55.02 v43.18,55.24
  Bottom 0.2: v43.18,55.24 44.62,56.68 v46.84,56.68
CURRENTC  (via drill 0.35)
  Top 0.2: IC1.7 37.43,36.04 40.81,32.66 v44.13,32.66 | v44.13,32.66 46.55,32.66 47.64,31.57 53.16,31.57 R16.1 | v44.13,32.66 44.21,32.59 44.21,30.95 44.79,30.37 54.91,30.37 56.36,31.81 56.36,35.4 59.93,38.97 66.44,38.97 CURRENT.13 CURRENT.14
CURRENTCPRECISE  (via drill 0.35)
  Top 0.2: v47.8,56.83 49.59,55.04 60.44,55.04 63.41,52.07 CURRENT.1 CURRENT.2
  Top 0.203: IC2.7 45.55,53.64 45.98,53.64 46.15,53.81 46.15,54.49 v44.92,55.72
  Bottom 0.2: v47.8,56.83 47.52,56.55 47.52,56.4 47.12,56 45.21,56 v44.92,55.72
CURRENTSUM  (via drill 0.35)
  Top 0.2: IC1.14 43.55,38.77 v44.14,39.36 48.25,39.36 R4.1 | v45.72,31.75 46.89,31.75 47.47,31.17 54.58,31.17 55.56,32.15 55.56,35.73 59.59,39.77 66.44,39.77 CURRENT.9 CURRENT.10
  Bottom 0.2: v44.14,39.36 44.42,39.08 45.21,38.29 45.21,32.26 v45.72,31.75
CURRENTVALLIMIT  (via drill 0.35)
  Top 0.2: IC1.13 44.11,38.37 v44.14,38.4 | CURRENTLIMIT.2 CURRENTLIMIT.1 67.82,29.97 57.35,29.97 56.49,30.82 55.93,30.82 55.08,29.97 44.62,29.97 43.81,30.79 43.81,31.64 v43.46,31.98
  Bottom 0.2: v43.46,31.98 43.46,32.38 43.45,32.38 43.45,37.73 43.85,38.12 43.87,38.12 v44.14,38.4
GND  (via drill 0.35)
  Top 0.2: v44.13,42.23 41.88,39.97 IC1.17 37.43,39.97 IC1.41 36.83,38.73 37.03,38.53 IC1.6 | 41.93,54.63 v42.13,54.83 | v50.48,48.89 47.94,48.89 47.66,48.62 45.05,48.62 44.77,48.89 v43.88,48.89 | v50.48,47.31 49.97,47.82 17.27,47.82 5.08,60.01 | 47.67,54.61 v47.95,54.61 | v48.26,46.74 49.05,45.95 v50.48,45.95 | IC1.6 37.03,37.47 | 59.69,44.13 R25.2 62.55,43.18 62.55,41.04 62.72,40.86 64.27,40.86 64.45,41.04 64.45,42.22 66.68,44.45 CURRENT.7 CURRENT.8 | 59.69,44.13 PS1.3 59.35,46.04 | 59.69,44.13 59.35,43.8 PS1.2 PS1.5 | PWMCL.C PWMCH.C PWMBL.C PWMBH.C PWMAL.C PWMAH.C 45.72,2.76 | R42.1 63.82,54.06 62.87,55.01 | 62.87,55.01 62.87,60.84 C10.- | LED11.C 69.6,67.66 69.6,67.56 | LED10.C 45.72,2.76 | 3.3V.4 45.72,2.76 | CHARGEPUMP.1 C14.1 | C14.1 C15.1 | C14.1 25.72,58.71 24.76,59.66 24.76,63.03 v24.45,63.35 | LED0.C LED1.C 10.69,52.17 18.13,44.72 18.78,44.72 v19.05,44.45 19.37,44.13 R22.2 | IC1.6 37.03,34.3 C4.2 37.03,31.73 37.03,22.66 3.3V.3 | v60.79,53.17 60.45,52.83 60.45,49.97 59.35,48.87 59.35,48.26 | 59.35,46.04 59.35,48.26 | v62.03,54.41 62.27,54.41 62.87,55.01 | C1.2 59.35,46.04 | 59.35,48.26 54.94,48.26 54.26,48.94 52.03,48.94 51.12,49.85 46.35,49.85 v46.04,49.53
  Top 0.203: R7.1 9.53,70.8 6.99,70.8 | 6.99,70.8 RSA.1 | 6.99,70.8 6.03,70.8 5.08,69.85 5.08,60.01 | RSB.1 29.84,70.8 27.3,70.8 | R14.1 27.3,70.8 | 27.3,70.8 26.03,70.8 25.57,70.34 25.57,60 26.51,59.05 32.61,59.05 33.24,58.43 38.14,58.43 41.93,54.63 42.92,53.64 43.35,53.64 IC2.2 | R17.1 50.16,70.8 47.62,70.8 | RSC.1 47.62,70.8 | 47.62,70.8 46.35,70.8 45.89,70.34 45.89,56.67 47.67,54.89 47.67,54.61 47.67,54.33 47.27,53.93 46.99,53.93 46.15,53.09 IC2.6 | IC2.9 44.05,52.94 44.05,52.81 43.83,52.59 IC2.4 42.04,52.59 v41.91,52.72
  Top 0.508: C10.- 69.6,67.56 71.12,69.09 VBAT.4 VBAT.3
  Bottom 0.2: v43.88,48.89 43.6,49.17 43.6,52.96 42.13,54.43 v42.13,54.83 | v50.48,48.89 v50.48,47.31 v50.48,45.95 R3.2 R10.2 50.48,34.92 R15.2 | v47.95,54.61 47.95,47.05 v48.26,46.74 | 3.3V.4 3.3V.3 3.3V1.4 3.3V1.3 | SW1.1 19.12,32.47 20.17,33.51 20.17,34.38 19.12,35.42 SW0.1 19.12,44.38 v19.05,44.45 | IC1.41 33.87,42.33 31.3,42.33 29.5,44.13 R22.2 | v60.79,53.17 v62.03,54.41 | v44.13,42.23 46.04,44.13 v46.04,49.53 46.04,54.62 47.02,55.6 47.53,55.6 48.48,56.55 48.48,57.11 48.08,57.51 46.71,57.51 46.35,57.15 42.65,57.15 C7.2 41.25,55.75 41.25,53.39 41.91,52.73 v41.91,52.72
  Bottom 0.508: VBAT.3 VBAT.4
  other vias: 50.48,41.91 48.58,33.02 50.48,37.47 36.83,39.37 27.94,44.13 42.01,56.52 26.67,68.58 27.94,68.58 29.21,68.58 30.48,68.58 30.48,67.31 29.21,67.31 27.94,67.31 26.67,67.31 26.67,66.04 27.94,66.04 29.21,66.04 30.48,66.04 6.35,68.58 7.62,68.58 8.89,68.58 10.16,68.58 10.16,67.31 8.89,67.31 7.62,67.31 6.35,67.31 6.35,66.04 7.62,66.04 8.89,66.04 10.16,66.04 46.99,68.58 48.26,68.58 49.53,68.58 50.8,68.58 50.8,67.31 49.53,67.31 48.26,67.31 46.99,67.31 46.99,66.04 48.26,66.04 49.53,66.04 50.8,66.04
  pour Top: 26.35,69.85 26.35,62.23 31.75,62.23 31.75,69.85
  pour Top: 6.03,69.85 6.03,62.23 11.43,62.23 11.43,69.85
  pour Top: 46.67,69.85 46.67,62.23 52.07,62.23 52.07,69.85
  pour Bottom (rank 2): 72.39,74.93 68.58,74.93 67.31,73.66 63.5,69.85 60.96,69.85 36.83,69.85 25.4,69.85 6.35,69.85 5.08,68.58 5.08,64.14 6.35,62.86 66.99,62.86 70.17,66.04 72.39,68.26
HSA  (via drill 0.35)
  Top 0.2: v39.38,44.45 39.1,44.17 37.83,42.9 IC1.23 | v20.05,51.36 34.36,51.36 35.45,50.27 v39.37,50.27 | QAH0.1 18.95,70.48 18.95,71.75 | 18.95,72.39 18.95,73.02 QAH1.1 | 19.05,68.48 19.15,68.38 19.15,68.16 19.55,67.76 19.55,65.96 19.85,65.66 19.85,65.41
  Top 0.203: 18.95,71.75 18.95,72.39 | QAH0.1 19.05,68.48 | HSA.1 19.05,61.81 19.85,62.61 19.85,65.41
  Bottom 0.2: v39.38,44.45 v39.38,50.26 v39.37,50.27 | v20.05,51.36 20.05,59.96 HSA.1
HSB  (via drill 0.35)
  Top 0.2: v40.33,44.45 40.06,44.17 39.66,43.77 39.63,43.77 38.23,42.37 IC1.22 | 39.27,72.39 39.27,73.02 QBH1.1 | 39.27,71.75 39.27,70.48 HBH0.1 39.47,68.38 39.47,67.86 40.01,67.32
  Top 0.203: 39.27,71.75 39.27,72.39 | HSB.1 39.37,61.81 40.17,62.61 40.17,67.16 40.01,67.32
  Bottom 0.2: v40.33,44.45 40.33,60 HSB.1
HSC  (via drill 0.35)
  Top 0.2: IC1.21 40.58,43.77 40.62,43.77 41.01,44.17 v41.29,44.45 | v59.69,50.16 55.89,50.16 55.84,50.12 55.28,50.12 55.14,50.27 51.83,50.27 51.45,50.65 45.63,50.65 45.25,50.27 v41.27,50.27 | QCH1.1 59.59,73.02 59.59,70.48 QCH0.1 59.79,68.38 59.79,67.86 60.01,67.63
  Top 0.203: HSC.1 59.69,61.81 60.49,62.61 60.49,67.16 60.01,67.63
  Bottom 0.2: v41.29,44.45 41.29,50.25 v41.27,50.27 | v59.69,50.16 59.69,52.92 59.83,53.06 59.83,53.62 59.69,53.76 HSC.1
LED0
  Top 0.2: GPIO.4 6.35,41.91 R37.2
LED1
  Top 0.2: GPIO.3 8.57,41.59 R38.2
LSA  (via drill 0.35)
  Top 0.2: IC1.18 40.08,40.37 43.88,44.17 v44.16,44.45 43.88,44.73 41.85,46.76 19.09,46.76 18.68,46.36 v17.83,46.36 | QAL1.1 13.87,73.02 13.87,70.48 QAL0.1
  Top 0.203: LSA.1 13.23,60.96 12.22,61.97 12.22,64.71 13.87,66.36 13.87,68.58 QAL0.1
  Bottom 0.2: v17.83,46.36 17.83,57.1 LSA.1
LSB  (via drill 0.35)
  Top 0.2: IC1.19 39.83,40.77 43.2,44.14 v43.2,44.45 42.92,44.73 41.62,46.04 v36.51,46.04 | QBL0.1 34.19,70.48 34.19,73.02 QBL1.1 | LSB.1 33.7,61.55 33.06,61.55 32.66,61.95 32.66,64.83 33.49,65.66
  Top 0.203: QBL0.1 34.19,68.58 34.19,66.36 33.49,65.66
  Bottom 0.2: LSB.1 34.29,55.89 35.92,54.26 35.92,46.63 v36.51,46.04
LSC  (via drill 0.35)
  Top 0.2: IC1.20 42.25,44.14 v42.25,44.45 | v54.85,49.59 51.94,49.59 51.28,50.25 45.8,50.25 45.14,49.59 v42.23,49.59 | LSC.1 54.02,61.55 53.38,61.55 52.98,61.95 52.98,65.67 53.81,66.5
  Top 0.203: QCL1.1 53.56,73.45 54.51,72.5 54.51,71.65 53.56,70.7 QCL0.1 53.56,69.01 54.51,68.05 54.51,67.2 53.81,66.5
  Bottom 0.2: v42.25,44.45 42.25,49.57 v42.23,49.59 | v54.85,49.59 54.85,60.72 LSC.1
MRX
  Top 0.2: IC1.37 33.5,38.77 32.85,38.13 32.85,24.53 24.83,16.51 R23.1 17.46,13.97 UART.6 UART.5 R32.2
MTX
  Top 0.2: R23.2 15.24,16.51 UART.4 UART.3 R33.2
N$1
  Top 0.2: IC1.31 31.42,44.13 R22.1
N$2
  Top 0.2: R26.1 PWMAH.A
N$3
  Top 0.2: PWMAL.A R27.1
N$4
  Top 0.2: R28.1 PWMBH.A
N$5
  Top 0.2: PWMBL.A R29.1
N$6
  Top 0.2: R30.1 PWMCH.A
N$7
  Top 0.2: PWMCL.A R31.1
N$8
  Top 0.2: MRX.C R32.1
N$9
  Top 0.2: R33.1 MTX.C
N$10
  Top 0.2: CE.C R34.1
N$11
  Top 0.2: LED10.A R35.1
N$12
  Top 0.2: LED11.A 68.26,70.9 R36.1
N$13
  Top 0.2: R37.1 LED0.A
N$14
  Top 0.2: R38.1 LED1.A
N$15
  Top 0.2: R42.2 R41.1 66.99,57.15 VBAT/11.1
PHA  (via drill 0.35)
  Top 0.2: IC1.26 36.63,44.02 v36.2,44.45 35.92,44.73 34.84,45.8 19.65,45.8 v19.37,46.08 | v12.9,62.26 12.9,63.91 BSA.2
  Top 0.203: BSA.2 C3.2 | C3.2 C2.2 | C3.2 16.51,69.12
  Top 0.508: QAL1.3 15.24,73.03
  Bottom 0.2: v19.37,46.08 19.37,58.74 17.57,60.53 17.57,61.4 16.63,62.35 12.99,62.35 v12.9,62.26
  pour Top (rank 2): 11.43,80.01 20.32,80.01 20.32,66.04 11.43,66.04
PHB  (via drill 0.35)
  Top 0.2: IC1.25 37.03,44.02 v37.46,44.45 | BSB.2 33.34,64.03 v33.34,62.23
  Top 0.203: C5.2 36.83,68.58 | C6.2 C5.2 | BSB.2 C5.2
  Bottom 0.2: v37.46,44.45 37.46,58.82 35.77,60.52 35.77,61.28 34.82,62.23 v33.34,62.23
  pour Top (rank 2): 31.75,80.01 40.64,80.01 40.64,66.04 31.75,66.04
PHC  (via drill 0.35)
  Top 0.2: v38.42,44.45 38.14,44.17 37.43,43.46 IC1.24 | v55.56,50.8 55.31,51.05 45.46,51.05 45.36,50.95 v38.42,50.95 | BSC.2 53.66,64.03 v53.66,62.23
  Top 0.203: BSC.2 C8.2 | C8.2 C9.2 | C8.2 57.15,69.12
  Bottom 0.2: v38.42,44.45 v38.42,50.94 v38.42,50.95 | v55.56,50.8 56.09,51.33 56.09,60.96 56.09,61.39 | 56.09,61.39 56.09,61.4 | v53.66,62.23 55.24,62.23 56.09,61.39
  pour Top (rank 2): 52.07,80.01 60.96,80.01 60.96,66.04 52.07,66.04
PWMAH
  Top 0.2: IC1.3 35.83,36.2 35.25,35.63 35.25,14.27 PWM.12 PWM.11 R26.2
PWMAL
  Top 0.2: IC1.2 35.43,36.37 34.85,35.8 34.85,15.8 PWM.10 PWM.9 R27.2
PWMBH
  Top 0.2: IC1.1 34.45,36.34 34.45,17.95 PWM.8 PWM.7 R28.2
PWMBL
  Top 0.2: IC1.40 34.05,37.24 34.05,20.09 PWM.6 PWM.5 R29.2
PWMCH
  Top 0.2: IC1.39 33.83,37.97 33.66,37.79 33.66,22.22 PWM.4 PWM.3 R30.2
PWMCL
  Top 0.2: IC1.38 33.66,38.37 33.25,37.96 33.25,24.36 PWM.2 PWM.1 R31.2
SENSEA  (via drill 0.35)
  Top 0.2: v54.65,47.59 54.26,47.59 53.3,46.63 50.2,46.63 49.41,47.42 17.1,47.42 4.96,59.57 | v54.65,44.13 R1.2 | 4.68,61.28 4.68,59.84 4.95,59.57 4.96,59.57 | 4.96,59.57 4.92,59.61
  Top 0.203: R7.2 9.53,71.44 6.99,71.44 | RSA.2 6.99,71.44 | 6.99,71.44 6.1,71.44 4.68,70.02 4.68,61.28
  Top 0.508: QAL0.2 11.43,69.12
  Top 1.27: 11.43,72.54 11.43,69.12 11.43,68.89 11.92,68.39 12.15,68.39 QAL0.2 | RSA.2 R7.2 11.43,72.54 | 11.43,72.54 12.45,72.54 QAL1.2
  Bottom 0.2: v54.65,47.59 v54.65,44.13
SENSEB  (via drill 0.35)
  Top 0.2: 41.65,54.35 41.93,54.07 v41.93,53.67 | v42.92,48.91 43.2,48.63 43.2,48.61 43.6,48.22 53.93,48.22 v53.98,48.26 | RSB.2 29.84,71.44
  Top 0.203: 29.84,71.44 27.3,71.44 | R14.2 27.3,71.44 | 27.3,71.44 26.1,71.44 25.16,70.5 25.16,59.83 26.34,58.65 32.45,58.65 33.07,58.02 37.97,58.02 41.65,54.35 42.85,53.14 43.35,53.14 IC2.3
  Top 0.508: QBL0.2 31.75,69.12
  Top 1.27: QBL1.2 32.77,72.54 31.75,72.54 | 31.75,72.54 RSB.2 R14.2 | 31.75,72.54 31.75,69.12 31.75,68.89 32.24,68.39 32.48,68.39 QBL0.2
  Bottom 0.2: v41.93,53.67 42.92,52.68 v42.92,48.91 | v53.98,48.26 53.98,42.54 R5.2 54.61,40.65 53.93,39.97 53.93,39.41 54.61,38.73 R8.2
  other vias: 54.61,41.91 54.61,37.47
SENSEBHIGH  (via drill 0.35)
  Top 0.2: IC1.12 43.61,37.97 v44.13,37.45 44.41,37.72 44.42,37.72 45.22,38.52 48.26,38.52 | R8.1 51.66,38.52 48.26,38.52 | 48.26,38.52
SENSEBLOW  (via drill 0.35)
  Top 0.2: IC1.11 43.05,37.57 43.85,36.77 v44.13,36.49 44.41,36.77 45.11,37.47 R10.1 | R10.1 | R11.2 48.58,37.14 R10.1
SENSEC  (via drill 0.35)
  Top 0.2: v47.3,46.67 47.37,46.67 48.77,45.27 50.76,45.27 51.72,46.23 54.89,46.23 v55.33,46.67
  Top 0.203: R17.2 50.16,71.44 47.62,71.44 | RSC.2 47.62,71.44 | 47.62,71.44 46.42,71.44 45.48,70.5 45.48,56.11 v46.99,54.61 | IC2.5 46.88,52.59 v46.99,52.7
  Top 0.508: QCL0.2 52.07,69.12
  Top 1.27: QCL1.2 53.09,72.54 52.07,72.54 | 52.07,72.54 R17.2 RSC.2 | 52.07,72.54 52.07,69.12 52.07,68.89 52.56,68.39 52.8,68.39 QCL0.2
  Bottom 0.2: 46.99,53.34 46.99,46.99 v47.3,46.67 | v55.33,46.67 55.33,40.41 R6.2 54.61,39.29 55.29,38.62 55.29,37.18 54.61,36.51 R12.2
  Bottom 0.203: v46.99,52.7 46.99,53.34 v46.99,54.61
  other vias: 54.61,39.69 54.61,35.24
SENSECHIGH  (via drill 0.35)
  Top 0.2: R12.1 51.53,34.07 47.93,34.07 47.42,34.58 v44.13,34.58 40.02,34.58 38.23,36.37 IC1.9
SENSECLOW  (via drill 0.35)
  Top 0.2: R16.2 R15.1 50.4,33.02 49.35,31.97 47.81,31.97 46.16,33.62 v44.13,33.62 40.41,33.62 37.83,36.2 IC1.8
SENSESUMHIGH  (via drill 0.35)
  Top 0.2: IC1.16 42.43,39.57 v44.13,41.27 46.03,41.27 48.89,44.13 R1.1 R5.1 R6.1
SENSESUMLOW  (via drill 0.35)
  Top 0.2: IC1.15 42.99,39.17 v44.14,40.31 46.98,40.31 R3.1 48.58,41.59 R4.2
SW0
  Top 0.2: GPIO.2 8.47,34.29 12.49,38.31 SW0.3 14.92,40.74 R39.1
SW1
  Top 0.2: GPIO.1 7.89,31.75 SW1.3 14.92,29.31 R40.1
VBA  (via drill 0.35)
  Top 0.2: IC1.29 35.43,42.37 35.25,42.55 35.23,42.55 v33.33,44.45 33.05,44.73 32.38,45.4 v18.41,45.4
  Top 0.203: BSA.1 C3.1 | C3.1 C2.1 | C3.1 VBA.1
  Bottom 0.2: v18.41,45.4 18.51,45.5 DA.C
  Bottom 0.203: DA.C 18.51,58.96 VBA.1
  other vias: 18.51,53.34
VBB  (via drill 0.35)
  Top 0.2: v34.28,44.45 34.56,44.17 35.83,42.9 IC1.28 | v34.29,54.93 37.24,54.93 DB.C
  Top 0.203: BSB.1 C5.1 | C5.1 C6.1 | VBB.1 C5.1
  Bottom 0.2: v34.28,44.45 v34.28,54.92 v34.29,54.93
  Bottom 0.203: DB.C 38.83,58.96 VBB.1
  other vias: 38.83,53.34
VBC  (via drill 0.35)
  Top 0.2: v35.24,44.45 35.52,44.17 36.23,43.46 IC1.27 | DC.C 57.57,53.34 55.86,51.62 35.43,51.62 v35.24,51.44
  Top 0.203: BSC.1 C8.1 | C8.1 C9.1 | VBC.1 C8.1
  Bottom 0.2: v35.24,44.45 v35.24,51.43 v35.24,51.44
  Bottom 0.203: DC.C 59.15,58.96 VBC.1
  other vias: 59.15,53.34
VCC  (via drill 0.35)
  Top 0.2: IC1.32 33.83,40.77 v31.59,43.01 v31.58,43.01 | R41.2 63.82,58.23 C10.+ | R36.2 66.36,73.98 VBAT.1
  Top 0.508: C10.+ 66.68,62.87 72.34,68.53 72.34,74.98 VBAT.2 VBAT.1
  Top 1.27: CC.+ 52.86,60.45 53.95,59.36 60.35,59.36 61.43,60.44 | CA.+ 12.22,60.45 13.31,59.36 19.71,59.36 20.79,60.44 | CB.+ 32.54,60.45 33.63,59.36 40.03,59.36 41.11,60.44
  Bottom 0.2: v31.58,43.01 31.69,43.12 31.69,61.54 33.06,62.91 34.7,62.91 35.59,62.02 52.49,62.02 53.38,62.91 55.13,62.91 56.02,62.02 60.13,62.02 61.19,60.96 66.99,60.96 66.87,61.09 C10.+
  Bottom 0.508: VBAT.2 VBAT.1
  other vias: 40.64,71.12 41.91,71.12 43.18,71.12 40.64,74.93 40.64,73.66 40.64,72.39 41.91,74.93 41.91,73.66 41.91,72.39 43.18,72.39 43.18,73.66 43.18,74.93 60.96,71.12 62.23,71.12 63.5,71.12 60.96,74.93 60.96,73.66 60.96,72.39 62.23,74.93 62.23,73.66 62.23,72.39 63.5,72.39 63.5,73.66 63.5,74.93 20.32,71.12 21.59,71.12 22.86,71.12 20.32,74.93 20.32,73.66 20.32,72.39 21.59,74.93 21.59,73.66 21.59,72.39 22.86,72.39 22.86,73.66 22.86,74.93
  pour Top: 44.45,75.56 44.45,58.74 39.37,58.74 39.37,76.2 44.45,76.2 44.45,75.56
  pour Top: 64.77,75.56 64.77,58.74 59.69,58.74 59.69,76.2 64.77,76.2
  pour Top: 24.13,75.56 24.13,58.74 19.05,58.74 19.05,76.2 24.13,76.2
  pour Bottom: 72.39,74.93 72.39,78.74 60.96,78.74 58.42,76.2 20.32,76.2 19.05,74.93 19.05,71.12 20.32,69.85 63.5,69.85 68.58,74.93
VREF
  Top 0.2: CURRENT.6 CURRENT.5 66.36,46.99 R25.1 R24.2

### Text on the board
tNames: + | - | C | PREC | B | VREF | - | S | B | C | - | +